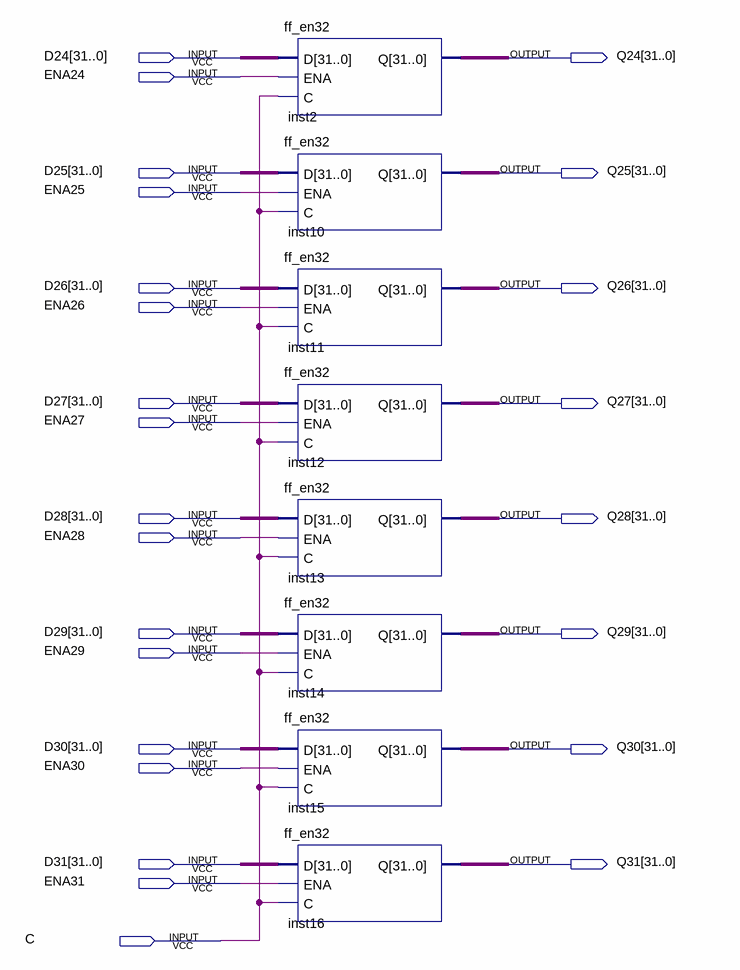
[diagram p0: schematic sheet]
// Quartus schematic ff8_en32_3.bdf as structural Verilog: 8 symbols, 25 pins
module ff8_en32_3 (
  input  [31:0] D24,
  input  ENA24,
  input  [31:0] D25,
  input  ENA25,
  input  [31:0] D26,
  input  ENA26,
  input  [31:0] D27,
  input  ENA27,
  input  [31:0] D28,
  input  ENA28,
  input  [31:0] D29,
  input  ENA29,
  input  [31:0] D30,
  input  ENA30,
  input  [31:0] D31,
  input  ENA31,
  input  C,
  output [31:0] Q24,
  output [31:0] Q25,
  output [31:0] Q26,
  output [31:0] Q27,
  output [31:0] Q28,
  output [31:0] Q29,
  output [31:0] Q30,
  output [31:0] Q31
);

  ff_en32 inst2 (.D(D24), .ENA(ENA24), .C(C), .Q(Q24));
  ff_en32 inst10 (.D(D25), .ENA(ENA25), .C(C), .Q(Q25));
  ff_en32 inst11 (.D(D26), .ENA(ENA26), .C(C), .Q(Q26));
  ff_en32 inst12 (.D(D27), .ENA(ENA27), .C(C), .Q(Q27));
  ff_en32 inst13 (.D(D28), .ENA(ENA28), .C(C), .Q(Q28));
  ff_en32 inst14 (.D(D29), .ENA(ENA29), .C(C), .Q(Q29));
  ff_en32 inst15 (.D(D30), .ENA(ENA30), .C(C), .Q(Q30));
  ff_en32 inst16 (.D(D31), .ENA(ENA31), .C(C), .Q(Q31));
endmodule
